# Altium schematic sheet MAX30102.SchDoc
size A; SheetNumber: 1; SheetTotal: 4
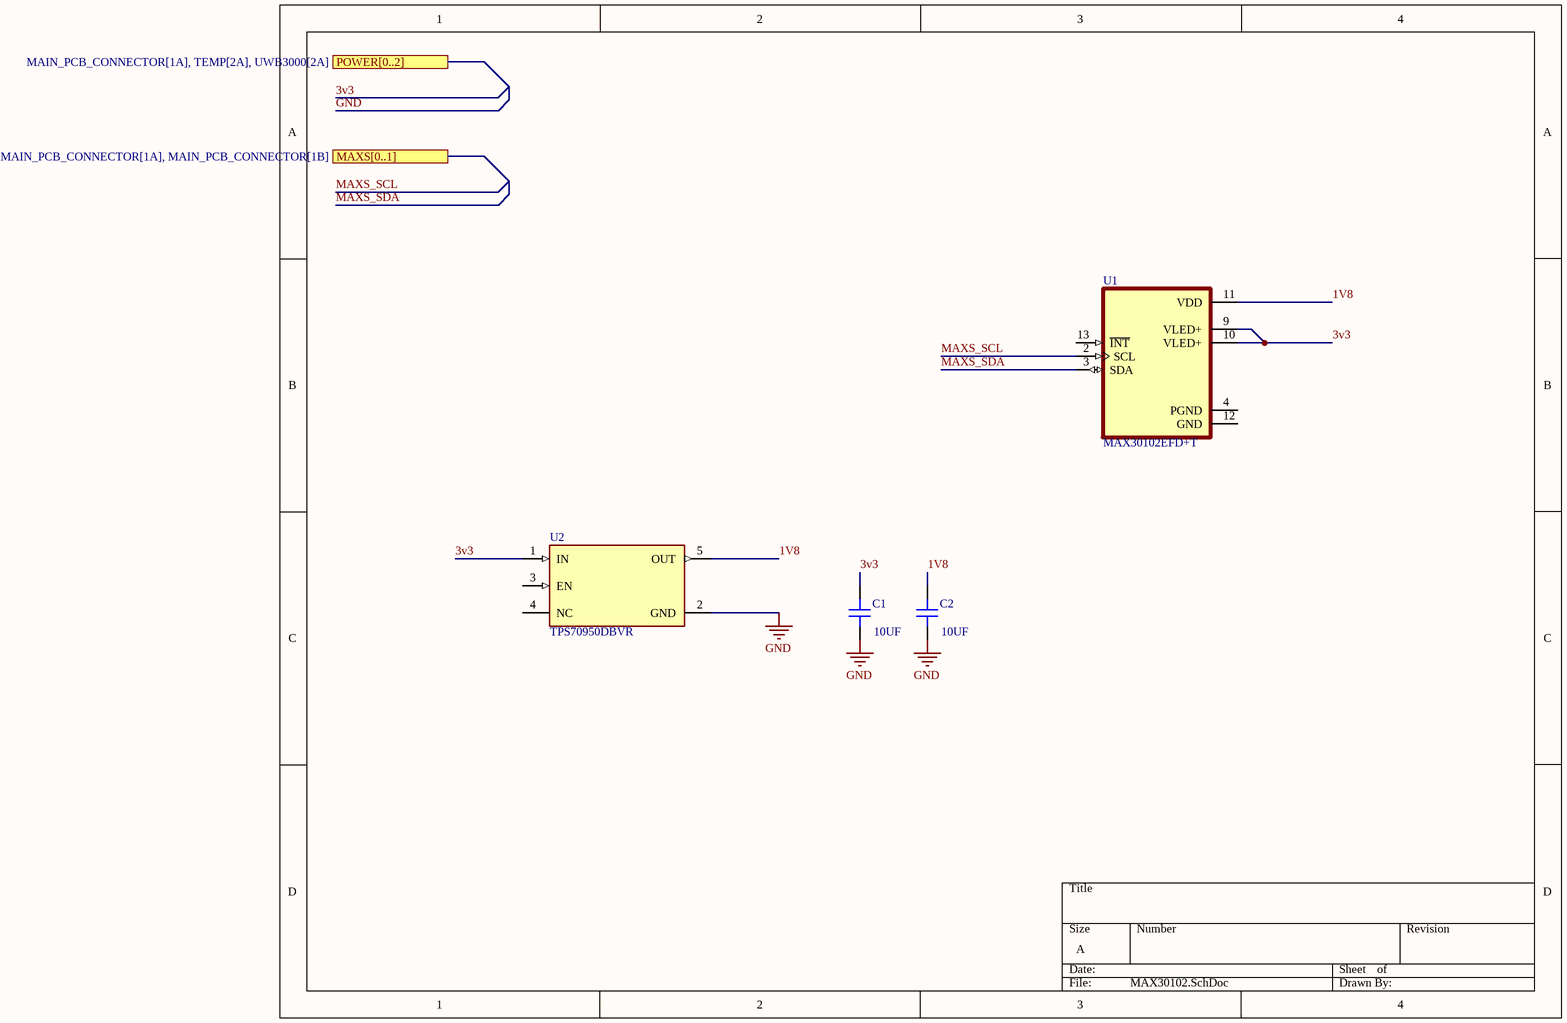
[diagram p0: MAX30102.SchDoc]

## Parts
C1  10UF  [CAP 0402_1005]
C2  10UF  [CAP 0402_1005]
U1  MAX30102EFD+T  [XDCR_MAX30101EFD+]
U2  TPS70950DBVR  [SOT95P280X145-5N]

## Ports
MAXS[0..1] (see MAIN_PCB_CONNECTOR[1A], MAIN_PCB_CONNECTOR[1B]), POWER[0..2] (see MAIN_PCB_CONNECTOR[1A], TEMP[2A], UWB3000[2A])

## Nets
GND: C1.1 C2.1 U2.2(GND)
1V8: C2.2 U1.11(VDD) U2.5(OUT)
3v3: C1.2 U1.9(VLED+) U1.10(VLED+) U2.1(IN)
MAXS_SCL: U1.2(SCL)
MAXS_SDA: U1.3(SDA)

Not connected (* = marked no-connect by the designer): U1 4(PGND) 12(GND) 13(~{INT}); U2 3(EN) 4(NC)

## Library data of the parts
C1 C2 = 0402X106M6R3CT: CAP CER 10UF 6.3V X5R 0402; MFR.Part #: CL05A106MQ5NUNC; Manufacturer: Samsung Electro-Mechanics; JLCPCB Part #: C15525; value: 10UF
U1 = MAX30102EFD+T: Pulse Oximeter and Heart Rate Sensor Digital Output; Manufacturer: Analog Devices Inc./Maxim Integrated; JLCPCB Part #: C6454833; MFR.Part #: MAX30102EFD+T
U2 = TPS70950DBVR: Manufacturer: Texas Instruments; JLCPCB Part #: C96028; MFR.Part #: TPS70950DBVR